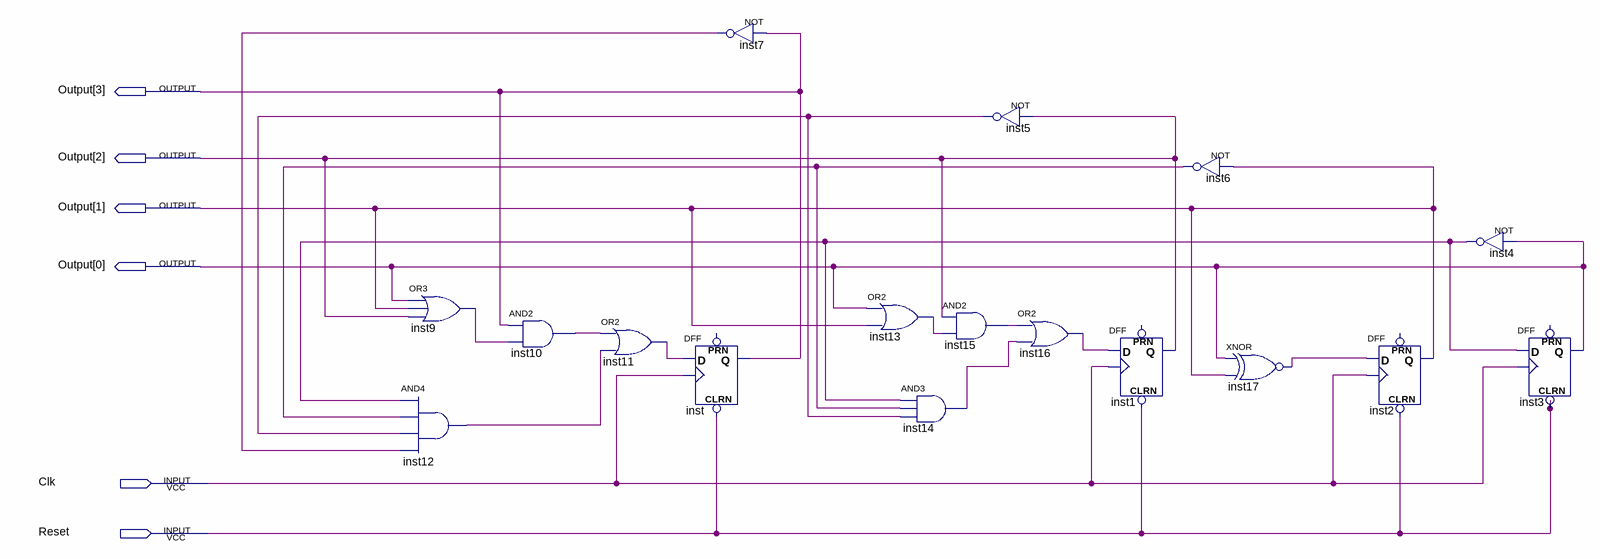
[diagram p0: schematic sheet]
// Quartus schematic DownCounter_Schematic.bdf as structural Verilog: 17 symbols, 6 pins
module DownCounter_Schematic (
  input  Clk,
  input  Reset,
  output [3:0] Output
);

  wire inst4_out, inst5_out, inst6_out, inst7_out, inst9_out, inst10_out, inst11_out, inst12_out, inst13_out,
       inst14_out, inst15_out, inst16_out, inst17_out;

  or inst9 (inst9_out, Output[0], Output[1], Output[2]);
  and inst12 (inst12_out, inst4_out, inst6_out, inst5_out, inst7_out);
  and inst10 (inst10_out, Output[3], inst9_out);
  or inst11 (inst11_out, inst10_out, inst12_out);
  not inst7 (inst7_out, Output[3]);
  DFF inst (.CLRN(Reset), .CLK(Clk), .D(inst11_out), .Q(Output[3]));  // open: PRN
  or inst13 (inst13_out, Output[0], Output[1]);
  and inst14 (inst14_out, inst4_out, inst6_out, inst5_out);
  not inst5 (inst5_out, Output[2]);
  and inst15 (inst15_out, Output[2], inst13_out);
  or inst16 (inst16_out, inst15_out, inst14_out);
  DFF inst1 (.CLRN(Reset), .CLK(Clk), .D(inst16_out), .Q(Output[2]));  // open: PRN
  not inst6 (inst6_out, Output[1]);
  xnor inst17 (inst17_out, Output[0], Output[1]);
  DFF inst2 (.CLRN(Reset), .CLK(Clk), .D(inst17_out), .Q(Output[1]));  // open: PRN
  not inst4 (inst4_out, Output[0]);
  DFF inst3 (.CLRN(Reset), .CLK(Clk), .D(inst4_out), .Q(Output[0]));  // open: PRN
endmodule
